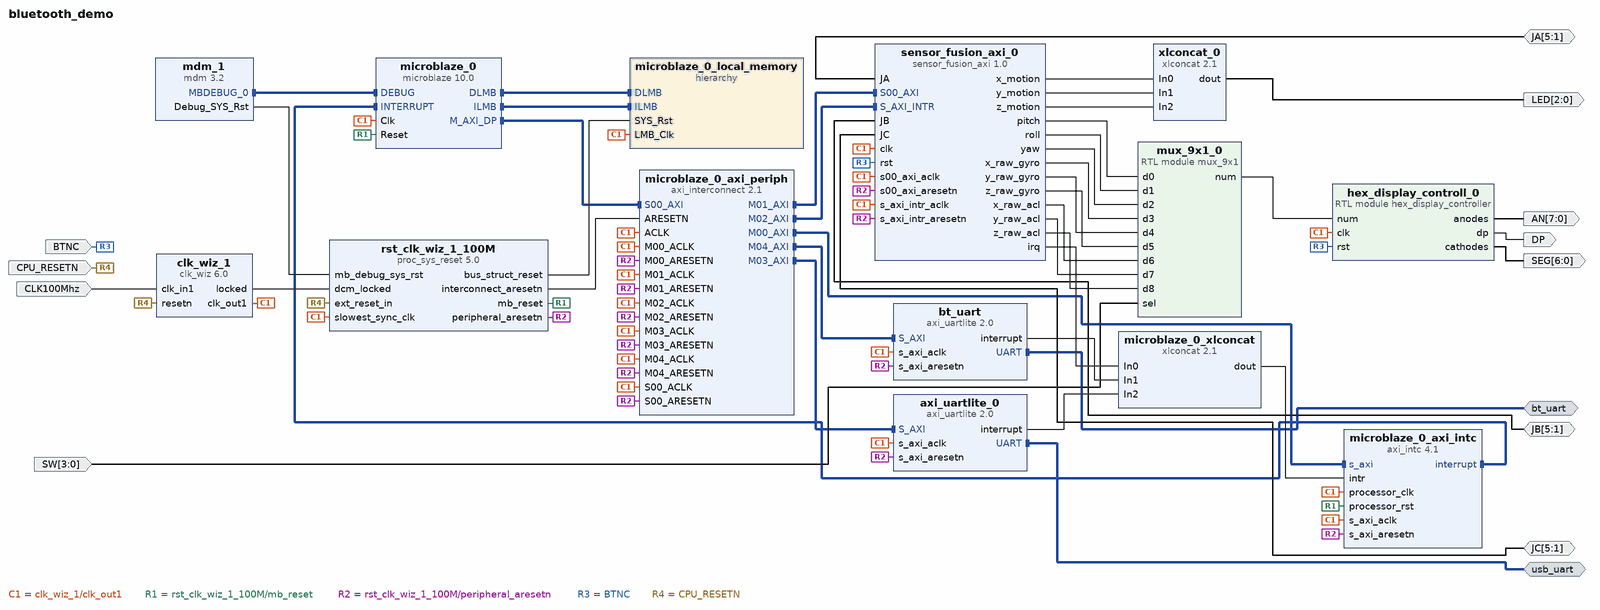
[diagram p0: block diagram of the top level]
# Vivado block design bluetooth_demo, xc7a100tcsg324-1, Vivado 2018.1
create_bd_design bluetooth_demo

create_bd_intf_port -mode Master -vlnv xilinx.com:interface:uart_rtl:1.0 bt_uart
create_bd_intf_port -mode Master -vlnv xilinx.com:interface:uart_rtl:1.0 usb_uart
create_bd_port -dir I -type rst BTNC
create_bd_port -dir IO -from 5 -to 1 JA
create_bd_port -dir IO -from 5 -to 1 JB
create_bd_port -dir IO -from 5 -to 1 JC
create_bd_port -dir O -from 2 -to 0 LED
create_bd_port -dir O -from 7 -to 0 AN
create_bd_port -dir O -from 6 -to 0 SEG
create_bd_port -dir O DP
create_bd_port -dir I -type rst CPU_RESETN
set_property -dict {CONFIG.POLARITY ACTIVE_LOW} [get_bd_ports CPU_RESETN]
create_bd_port -dir I -type clk CLK100Mhz
set_property -dict {CONFIG.FREQ_HZ 100000000 CONFIG.PHASE 0.000} [get_bd_ports CLK100Mhz]
create_bd_port -dir I -from 3 -to 0 SW

create_bd_cell -type ip -vlnv xilinx.com:ip:microblaze:10.0 microblaze_0
set_property -dict {CONFIG.C_D_AXI 1 CONFIG.C_D_LMB 1 CONFIG.C_I_LMB 1 CONFIG.C_DEBUG_ENABLED 1} [get_bd_cells microblaze_0]
create_bd_cell -type hier microblaze_0_local_memory
create_bd_cell -type ip -vlnv xilinx.com:ip:axi_interconnect:2.1 microblaze_0_axi_periph
set_property -dict {CONFIG.NUM_MI 5} [get_bd_cells microblaze_0_axi_periph]
create_bd_cell -type ip -vlnv xilinx.com:ip:axi_intc:4.1 microblaze_0_axi_intc
set_property -dict {CONFIG.C_HAS_FAST 1} [get_bd_cells microblaze_0_axi_intc]
create_bd_cell -type ip -vlnv xilinx.com:ip:xlconcat:2.1 microblaze_0_xlconcat
set_property -dict {CONFIG.NUM_PORTS 3} [get_bd_cells microblaze_0_xlconcat]
create_bd_cell -type ip -vlnv xilinx.com:ip:mdm:3.2 mdm_1
create_bd_cell -type ip -vlnv xilinx.com:ip:clk_wiz:6.0 clk_wiz_1
set_property -dict [list \
  CONFIG.PRIM_SOURCE Single_ended_clock_capable_pin \
  CONFIG.RESET_PORT resetn \
  CONFIG.RESET_TYPE ACTIVE_LOW \
  CONFIG.USE_BOARD_FLOW true \
  CONFIG.CLK_IN1_BOARD_INTERFACE sys_clock \
  CONFIG.RESET_BOARD_INTERFACE reset \
] [get_bd_cells clk_wiz_1]
create_bd_cell -type ip -vlnv xilinx.com:ip:proc_sys_reset:5.0 rst_clk_wiz_1_100M
set_property -dict {CONFIG.USE_BOARD_FLOW true CONFIG.RESET_BOARD_INTERFACE reset} [get_bd_cells rst_clk_wiz_1_100M]
create_bd_cell -type ip -vlnv user:user:sensor_fusion_axi:1.0 sensor_fusion_axi_0
create_bd_cell -type ip -vlnv xilinx.com:ip:axi_uartlite:2.0 axi_uartlite_0
set_property -dict [list \
  CONFIG.C_BAUDRATE 115200 \
  CONFIG.USE_BOARD_FLOW true \
  CONFIG.UARTLITE_BOARD_INTERFACE usb_uart \
] [get_bd_cells axi_uartlite_0]
create_bd_cell -type ip -vlnv xilinx.com:ip:axi_uartlite:2.0 bt_uart
set_property -dict {CONFIG.C_BAUDRATE 115200} [get_bd_cells bt_uart]
create_bd_cell -type module -reference mux_9x1 mux_9x1_0
create_bd_cell -type ip -vlnv xilinx.com:ip:xlconcat:2.1 xlconcat_0
set_property -dict {CONFIG.NUM_PORTS 3} [get_bd_cells xlconcat_0]
create_bd_cell -type module -reference hex_display_controller hex_display_controll_0

# ---- hierarchy /microblaze_0_local_memory ----
current_bd_instance /microblaze_0_local_memory
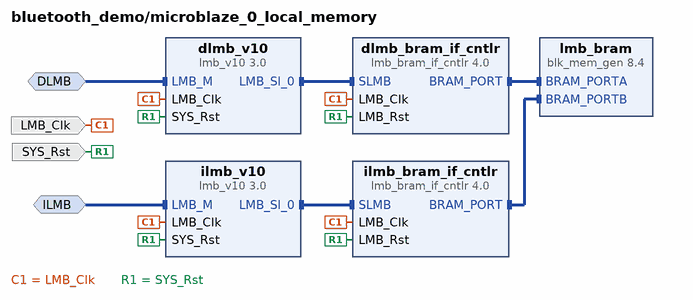
[diagram p1: block diagram inside /microblaze_0_local_memory]
create_bd_intf_pin -mode MirroredMaster -vlnv xilinx.com:interface:lmb_rtl:1.0 DLMB
create_bd_intf_pin -mode MirroredMaster -vlnv xilinx.com:interface:lmb_rtl:1.0 ILMB
create_bd_pin -dir I -type clk LMB_Clk
create_bd_pin -dir I -type rst SYS_Rst

create_bd_cell -type ip -vlnv xilinx.com:ip:lmb_v10:3.0 dlmb_v10
create_bd_cell -type ip -vlnv xilinx.com:ip:lmb_v10:3.0 ilmb_v10
create_bd_cell -type ip -vlnv xilinx.com:ip:lmb_bram_if_cntlr:4.0 dlmb_bram_if_cntlr
set_property -dict {CONFIG.C_ECC 0} [get_bd_cells dlmb_bram_if_cntlr]
create_bd_cell -type ip -vlnv xilinx.com:ip:lmb_bram_if_cntlr:4.0 ilmb_bram_if_cntlr
set_property -dict {CONFIG.C_ECC 0} [get_bd_cells ilmb_bram_if_cntlr]
create_bd_cell -type ip -vlnv xilinx.com:ip:blk_mem_gen:8.4 lmb_bram
set_property -dict {CONFIG.Memory_Type True_Dual_Port_RAM CONFIG.use_bram_block BRAM_Controller} [get_bd_cells lmb_bram]

# ---- connections ----

current_bd_instance /microblaze_0_local_memory
connect_bd_intf_net -intf_net microblaze_0_dlmb_bus [get_bd_intf_pins dlmb_v10/LMB_Sl_0] [get_bd_intf_pins dlmb_bram_if_cntlr/SLMB]
connect_bd_intf_net -intf_net microblaze_0_ilmb_bus [get_bd_intf_pins ilmb_v10/LMB_Sl_0] [get_bd_intf_pins ilmb_bram_if_cntlr/SLMB]
connect_bd_intf_net -intf_net microblaze_0_dlmb_cntlr [get_bd_intf_pins dlmb_bram_if_cntlr/BRAM_PORT] [get_bd_intf_pins lmb_bram/BRAM_PORTA]
connect_bd_intf_net -intf_net microblaze_0_ilmb_cntlr [get_bd_intf_pins ilmb_bram_if_cntlr/BRAM_PORT] [get_bd_intf_pins lmb_bram/BRAM_PORTB]
connect_bd_intf_net -intf_net microblaze_0_dlmb [get_bd_intf_pins DLMB] [get_bd_intf_pins dlmb_v10/LMB_M]
connect_bd_intf_net -intf_net microblaze_0_ilmb [get_bd_intf_pins ILMB] [get_bd_intf_pins ilmb_v10/LMB_M]
connect_bd_net -net microblaze_0_Clk [get_bd_pins LMB_Clk] \
  [get_bd_pins dlmb_v10/LMB_Clk] [get_bd_pins dlmb_bram_if_cntlr/LMB_Clk] [get_bd_pins ilmb_v10/LMB_Clk] \
  [get_bd_pins ilmb_bram_if_cntlr/LMB_Clk]
connect_bd_net [get_bd_pins SYS_Rst] \
  [get_bd_pins dlmb_v10/SYS_Rst] [get_bd_pins dlmb_bram_if_cntlr/LMB_Rst] [get_bd_pins ilmb_v10/SYS_Rst] \
  [get_bd_pins ilmb_bram_if_cntlr/LMB_Rst]

current_bd_instance /
connect_bd_intf_net [get_bd_intf_pins microblaze_0/DLMB] [get_bd_intf_pins microblaze_0_local_memory/DLMB]
connect_bd_intf_net [get_bd_intf_pins microblaze_0/ILMB] [get_bd_intf_pins microblaze_0_local_memory/ILMB]
connect_bd_intf_net -intf_net microblaze_0_axi_dp [get_bd_intf_pins microblaze_0_axi_periph/S00_AXI] [get_bd_intf_pins microblaze_0/M_AXI_DP]
connect_bd_intf_net [get_bd_intf_pins microblaze_0_axi_intc/interrupt] [get_bd_intf_pins microblaze_0/INTERRUPT]
connect_bd_intf_net -intf_net microblaze_0_intc_axi [get_bd_intf_pins microblaze_0_axi_periph/M00_AXI] [get_bd_intf_pins microblaze_0_axi_intc/s_axi]
connect_bd_intf_net [get_bd_intf_pins mdm_1/MBDEBUG_0] [get_bd_intf_pins microblaze_0/DEBUG]
connect_bd_intf_net [get_bd_intf_pins microblaze_0_axi_periph/M01_AXI] [get_bd_intf_pins sensor_fusion_axi_0/S00_AXI]
connect_bd_intf_net [get_bd_intf_pins microblaze_0_axi_periph/M02_AXI] [get_bd_intf_pins sensor_fusion_axi_0/S_AXI_INTR]
connect_bd_intf_net [get_bd_intf_pins microblaze_0_axi_periph/M03_AXI] [get_bd_intf_pins axi_uartlite_0/S_AXI]
connect_bd_intf_net [get_bd_intf_pins microblaze_0_axi_periph/M04_AXI] [get_bd_intf_pins bt_uart/S_AXI]
connect_bd_intf_net [get_bd_intf_ports bt_uart] [get_bd_intf_pins bt_uart/UART]
connect_bd_intf_net [get_bd_intf_ports usb_uart] [get_bd_intf_pins axi_uartlite_0/UART]
connect_bd_net -net microblaze_0_intr [get_bd_pins microblaze_0_xlconcat/dout] [get_bd_pins microblaze_0_axi_intc/intr]
connect_bd_net -net microblaze_0_Clk [get_bd_pins clk_wiz_1/clk_out1] \
  [get_bd_pins microblaze_0/Clk] [get_bd_pins microblaze_0_axi_periph/ACLK] [get_bd_pins microblaze_0_axi_periph/S00_ACLK] \
  [get_bd_pins microblaze_0_axi_periph/M00_ACLK] [get_bd_pins microblaze_0_axi_intc/s_axi_aclk] \
  [get_bd_pins microblaze_0_axi_intc/processor_clk] [get_bd_pins microblaze_0_local_memory/LMB_Clk] \
  [get_bd_pins rst_clk_wiz_1_100M/slowest_sync_clk] [get_bd_pins sensor_fusion_axi_0/s00_axi_aclk] \
  [get_bd_pins microblaze_0_axi_periph/M01_ACLK] [get_bd_pins sensor_fusion_axi_0/s_axi_intr_aclk] \
  [get_bd_pins microblaze_0_axi_periph/M02_ACLK] [get_bd_pins sensor_fusion_axi_0/clk] \
  [get_bd_pins axi_uartlite_0/s_axi_aclk] [get_bd_pins microblaze_0_axi_periph/M03_ACLK] [get_bd_pins bt_uart/s_axi_aclk] \
  [get_bd_pins microblaze_0_axi_periph/M04_ACLK] [get_bd_pins hex_display_controll_0/clk]
connect_bd_net [get_bd_pins clk_wiz_1/locked] [get_bd_pins rst_clk_wiz_1_100M/dcm_locked]
connect_bd_net [get_bd_pins rst_clk_wiz_1_100M/mb_reset] [get_bd_pins microblaze_0/Reset] [get_bd_pins microblaze_0_axi_intc/processor_rst]
connect_bd_net [get_bd_pins rst_clk_wiz_1_100M/bus_struct_reset] [get_bd_pins microblaze_0_local_memory/SYS_Rst]
connect_bd_net [get_bd_pins rst_clk_wiz_1_100M/interconnect_aresetn] [get_bd_pins microblaze_0_axi_periph/ARESETN]
connect_bd_net [get_bd_pins rst_clk_wiz_1_100M/peripheral_aresetn] \
  [get_bd_pins microblaze_0_axi_periph/S00_ARESETN] [get_bd_pins microblaze_0_axi_periph/M00_ARESETN] \
  [get_bd_pins microblaze_0_axi_intc/s_axi_aresetn] [get_bd_pins sensor_fusion_axi_0/s00_axi_aresetn] \
  [get_bd_pins microblaze_0_axi_periph/M01_ARESETN] [get_bd_pins sensor_fusion_axi_0/s_axi_intr_aresetn] \
  [get_bd_pins microblaze_0_axi_periph/M02_ARESETN] [get_bd_pins axi_uartlite_0/s_axi_aresetn] \
  [get_bd_pins microblaze_0_axi_periph/M03_ARESETN] [get_bd_pins bt_uart/s_axi_aresetn] \
  [get_bd_pins microblaze_0_axi_periph/M04_ARESETN]
connect_bd_net [get_bd_pins mdm_1/Debug_SYS_Rst] [get_bd_pins rst_clk_wiz_1_100M/mb_debug_sys_rst]
connect_bd_net [get_bd_pins mux_9x1_0/num] [get_bd_pins hex_display_controll_0/num]
connect_bd_net -net rst_0_1 [get_bd_ports BTNC] [get_bd_pins sensor_fusion_axi_0/rst] [get_bd_pins hex_display_controll_0/rst]
connect_bd_net [get_bd_ports JA] [get_bd_pins sensor_fusion_axi_0/JA]
connect_bd_net [get_bd_ports JB] [get_bd_pins sensor_fusion_axi_0/JB]
connect_bd_net [get_bd_ports JC] [get_bd_pins sensor_fusion_axi_0/JC]
connect_bd_net [get_bd_pins sensor_fusion_axi_0/x_motion] [get_bd_pins xlconcat_0/In0]
connect_bd_net [get_bd_pins sensor_fusion_axi_0/y_motion] [get_bd_pins xlconcat_0/In1]
connect_bd_net [get_bd_pins sensor_fusion_axi_0/z_motion] [get_bd_pins xlconcat_0/In2]
connect_bd_net [get_bd_pins xlconcat_0/dout] [get_bd_ports LED]
connect_bd_net [get_bd_pins hex_display_controll_0/anodes] [get_bd_ports AN]
connect_bd_net [get_bd_pins hex_display_controll_0/cathodes] [get_bd_ports SEG]
connect_bd_net [get_bd_pins hex_display_controll_0/dp] [get_bd_ports DP]
connect_bd_net -net reset_1 [get_bd_ports CPU_RESETN] [get_bd_pins clk_wiz_1/resetn] [get_bd_pins rst_clk_wiz_1_100M/ext_reset_in]
connect_bd_net -net sys_clock_1 [get_bd_ports CLK100Mhz] [get_bd_pins clk_wiz_1/clk_in1]
connect_bd_net [get_bd_pins sensor_fusion_axi_0/irq] [get_bd_pins microblaze_0_xlconcat/In0]
connect_bd_net [get_bd_pins bt_uart/interrupt] [get_bd_pins microblaze_0_xlconcat/In1]
connect_bd_net [get_bd_pins axi_uartlite_0/interrupt] [get_bd_pins microblaze_0_xlconcat/In2]
connect_bd_net [get_bd_pins sensor_fusion_axi_0/pitch] [get_bd_pins mux_9x1_0/d0]
connect_bd_net [get_bd_pins sensor_fusion_axi_0/roll] [get_bd_pins mux_9x1_0/d1]
connect_bd_net [get_bd_pins sensor_fusion_axi_0/yaw] [get_bd_pins mux_9x1_0/d2]
connect_bd_net [get_bd_pins sensor_fusion_axi_0/x_raw_gyro] [get_bd_pins mux_9x1_0/d3]
connect_bd_net [get_bd_pins sensor_fusion_axi_0/y_raw_gyro] [get_bd_pins mux_9x1_0/d4]
connect_bd_net [get_bd_pins sensor_fusion_axi_0/z_raw_gyro] [get_bd_pins mux_9x1_0/d5]
connect_bd_net [get_bd_pins sensor_fusion_axi_0/x_raw_acl] [get_bd_pins mux_9x1_0/d6]
connect_bd_net [get_bd_pins sensor_fusion_axi_0/y_raw_acl] [get_bd_pins mux_9x1_0/d7]
connect_bd_net [get_bd_pins sensor_fusion_axi_0/z_raw_acl] [get_bd_pins mux_9x1_0/d8]
connect_bd_net -net sel_0_1 [get_bd_ports SW] [get_bd_pins mux_9x1_0/sel]

# ---- address map ----
assign_bd_address -offset 0x00000000 -range 128K -target_address_space [get_bd_addr_spaces microblaze_0/Data] [get_bd_addr_segs microblaze_0_local_memory/dlmb_bram_if_cntlr/SLMB/Mem]
assign_bd_address -offset 0x40600000 -range 64K -target_address_space [get_bd_addr_spaces microblaze_0/Data] [get_bd_addr_segs axi_uartlite_0/S_AXI/Reg]
assign_bd_address -offset 0x40610000 -range 64K -target_address_space [get_bd_addr_spaces microblaze_0/Data] [get_bd_addr_segs bt_uart/S_AXI/Reg]
assign_bd_address -offset 0x41200000 -range 64K -target_address_space [get_bd_addr_spaces microblaze_0/Data] [get_bd_addr_segs microblaze_0_axi_intc/S_AXI/Reg]
assign_bd_address -offset 0x44A00000 -range 64K -target_address_space [get_bd_addr_spaces microblaze_0/Data] [get_bd_addr_segs sensor_fusion_axi_0/S00_AXI/S00_AXI_reg]
assign_bd_address -offset 0x44A10000 -range 64K -target_address_space [get_bd_addr_spaces microblaze_0/Data] [get_bd_addr_segs sensor_fusion_axi_0/S_AXI_INTR/S_AXI_INTR_reg]
assign_bd_address -offset 0x00000000 -range 128K -target_address_space [get_bd_addr_spaces microblaze_0/Instruction] [get_bd_addr_segs microblaze_0_local_memory/ilmb_bram_if_cntlr/SLMB/Mem]

validate_bd_design
save_bd_design
